# Altium schematic sheet obc-v2_EXP-I2C-IRQ.SchDoc
size 420 x 297 mm; SheetNumber: 11; SheetTotal: 21
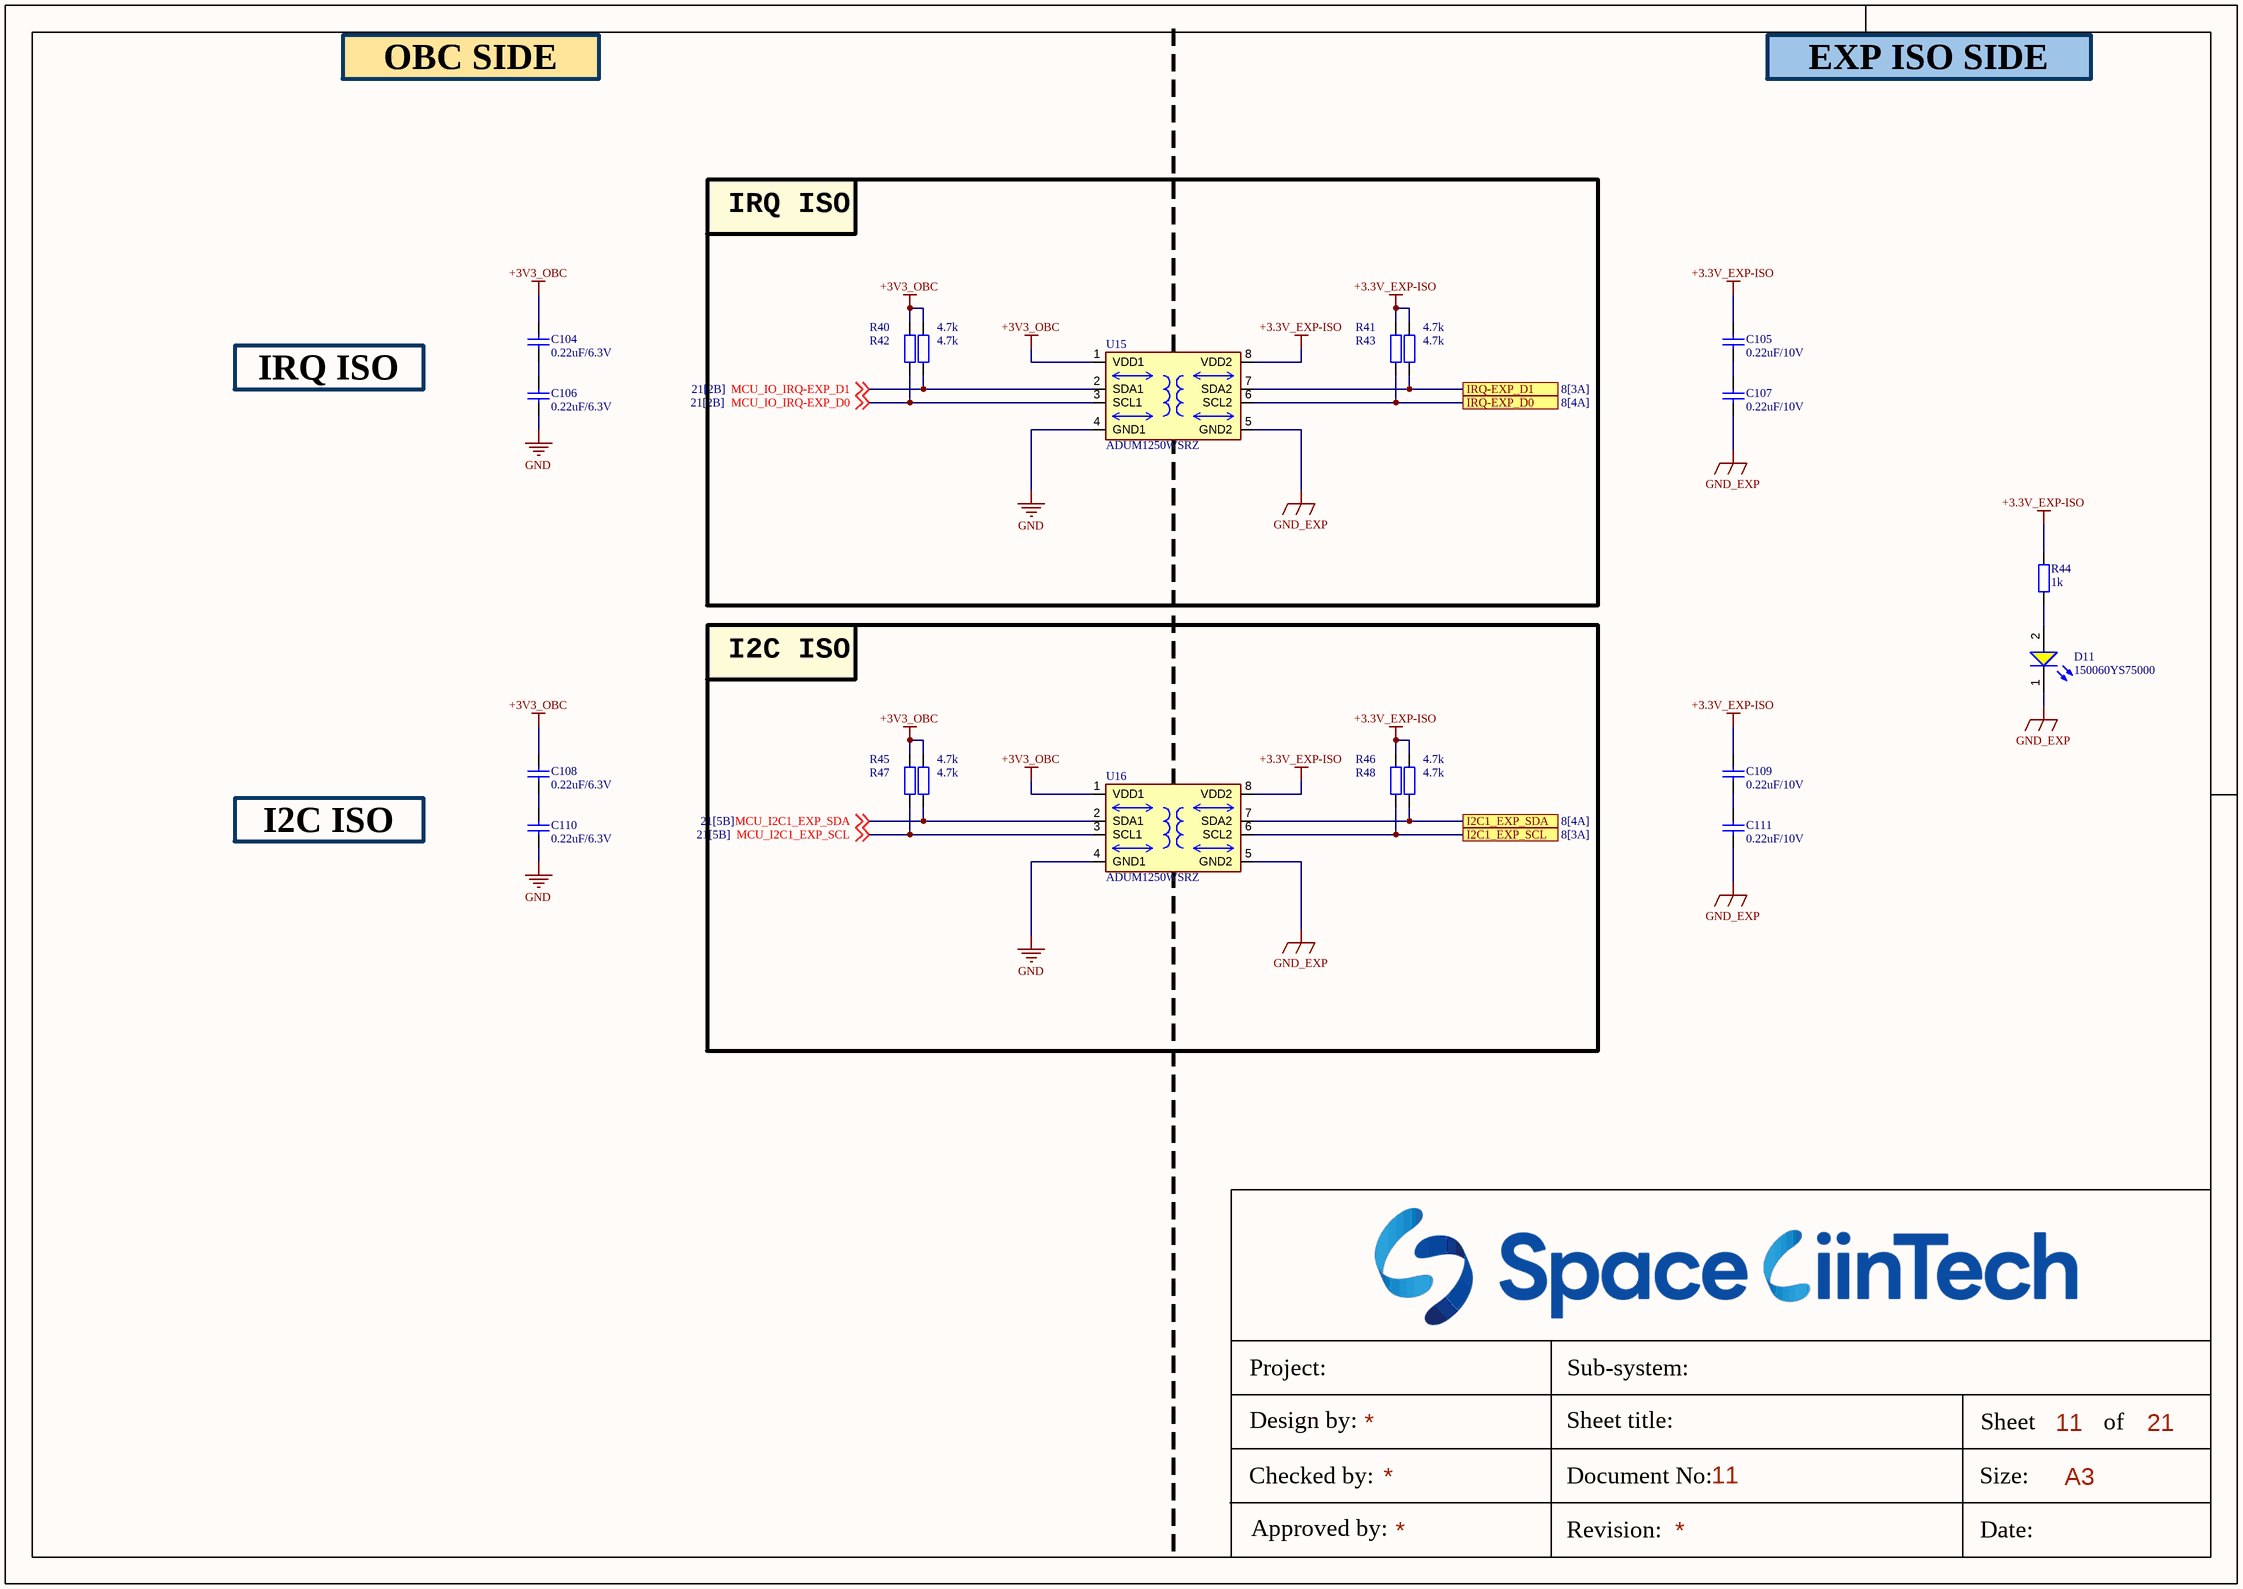
[diagram p0: obc-v2_EXP-I2C-IRQ.SchDoc]

## Parts
C104  0.22uF/6.3V  [CAP_C_1005X60]
C105  0.22uF/10V  [CAP_C_1005X60]
C106  0.22uF/6.3V  [CAP_C_1005X60]
C107  0.22uF/10V  [CAP_C_1005X60]
C108  0.22uF/6.3V  [CAP_C_1005X60]
C109  0.22uF/10V  [CAP_C_1005X60]
C110  0.22uF/6.3V  [CAP_C_1005X60]
C111  0.22uF/10V  [CAP_C_1005X60]
D11  150060YS75000  [WL-SMCW_0603_150060xx75000]
R40  4.7k  [RES_C_1608X60]
R41  4.7k  [RES_C_1608X60]
R42  4.7k  [RES_C_1608X60]
R43  4.7k  [RES_C_1608X60]
R44  1k  [RES_C_1608X60]
R45  4.7k  [RES_C_1608X60]
R46  4.7k  [RES_C_1608X60]
R47  4.7k  [RES_C_1608X60]
R48  4.7k  [RES_C_1608X60]
U15  ADUM1250WSRZ  [SOIC127P602X173-8N]
U16  ADUM1250WSRZ  [SOIC127P602X173-8N]

## Blocks framed on the sheet
IRQ ISO: R40-R43 U15
I2C ISO: R45-R48 U16

## Ports
I2C1_EXP_SCL (see 8[3A]), I2C1_EXP_SDA (see 8[4A]), IRQ-EXP_D0 (see 8[4A]), IRQ-EXP_D1 (see 8[3A])

## Nets
+3.3V_EXP-ISO: C105.1 C109.1 R41.2 R43.2 R44.2 R46.2 R48.2 U15.8(VDD2) U16.8(VDD2)
+3V3_OBC: C104.1 C108.1 R40.2 R42.2 R45.2 R47.2 U15.1(VDD1) U16.1(VDD1)
GND: C106.2 C110.2 U15.4(GND1) U16.4(GND1)
GND_EXP: C107.2 C111.2 D11.1(K) U15.5(GND2) U16.5(GND2)
I2C1_EXP_SCL: R46.1 U16.6(SCL2) ; port I2C1_EXP_SCL
I2C1_EXP_SDA: R48.1 U16.7(SDA2) ; port I2C1_EXP_SDA
IRQ-EXP_D0: R41.1 U15.6(SCL2) ; port IRQ-EXP_D0
IRQ-EXP_D1: R43.1 U15.7(SDA2) ; port IRQ-EXP_D1
MCU_I2C1_EXP_SCL: R45.1 U16.3(SCL1) ; off-sheet MCU_I2C1_EXP_SCL
MCU_I2C1_EXP_SDA: R47.1 U16.2(SDA1) ; off-sheet MCU_I2C1_EXP_SDA
MCU_IO_IRQ-EXP_D0: R40.1 U15.3(SCL1) ; off-sheet MCU_IO_IRQ-EXP_D0
MCU_IO_IRQ-EXP_D1: R42.1 U15.2(SDA1) ; off-sheet MCU_IO_IRQ-EXP_D1
NetC104_2: C104.2 C106.1
NetC105_2: C105.2 C107.1
NetC108_2: C108.2 C110.1
NetC109_2: C109.2 C111.1
NetD11_2: D11.2(A) R44.1

## Notes on the sheet
- OBC SIDE
- EXP ISO SIDE
- IRQ ISO
- I2C ISO
- Project:
- Sub-system:
- Design by:
- Sheet title:
- Sheet
- A3
- of
- Checked by:
- Approved by:
- Revision:
- Document No:
- Size:
- Date:

## Library data of the parts
C104-C111 = Tu 0402 33nF 10V: CAPC; Chung_Loai: Dán; Don_Vi: Con; So_Chan: 2; Ten_Linh_Kien: Tụ 0402 33nF X7R 10V GRM155R71A333KA01D; Ma_Hang: MH007853; Kieu_Chan: *
D11 = CMP-1426-00005-2: LED YELLOW CLEAR 0603 SMD; NexarPartId: 29687085; Wavelength: 590nm; Luminous Intensity: 120mcd; Peak Wavelength: 595nm; Forward Current: 100mA; Power Dissipation: 72mW; Forward Voltage: 2V; Test Current: 20mA; Reverse Voltage: 5V; Lens Style: Clear, Rectangular; Max Junction Temperature (Tj): 95°C; Viewing Angle: 140°; Case Code (Imperial): 0603; Height: 700µm; REACH SVHC: Unknown; Dominant Wavelength: 590nm; Min Operating Temperature: -40°C; Color: Yellow; Width: 800µm; Mount: Surface Mount; Packaging: Tape and Reel; Max Operating Temperature: 85°C; RoHS: Compliant; Max Reverse Voltage (DC): 5V; Case Code (Metric): 1608; Length: 1.6mm; Case/Package: 0603
R40-R48 = Tro 0603 1% 10k: RES; Chung_Loai: Dán; Don_Vi: Con; So_Chan: 2; Ten_Linh_Kien: Trở 0603 1% 10k; Ma_Hang: MH006333; Kieu_Chan: *
U15 U16 = ADUM1250: IÂ²C Digital Isolator 2500Vrms 2 Channel 1Mbps 25kV/Âµs CMTI 8-SOIC (0.154", 3.90mm Width); MF: Analog Devices; Package: SOIC-8; Price: None; Value: *; SnapEDA_Link: https://www.snapeda.com/parts/ADUM1250/Analog+Devices/view-part/?ref=snap; MP: ADUM1250; Availability: Unavailable; Check_prices: https://www.snapeda.com/parts/ADUM1250/Analog+Devices/view-part/?ref=eda